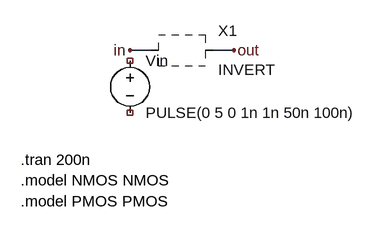
[diagram p0: schematic INVERT_test.asc]
INVERT_test.asc, the LTspice schematic file:
Version 4
.lib "C:\Users\ryano\OneDrive\Desktop\LogicLibraryAlt\simulation_build\ModelSp2025.txt"SHEET 1 880 680
WIRE 176 128 144 128
WIRE 304 128 272 128
FLAG 304 128 out
FLAG 144 128 in
SYMBOL INVERT 224 128 R0
SYMATTR InstName X1
SYMBOL voltage 144 128 R0
WINDOW 123 0 0 Left 0
WINDOW 39 0 0 Left 0
SYMATTR InstName Vin
SYMATTR Value PULSE(0 5 0 1n 1n 50n 100n)
TEXT -24 296 Left 2 !.tran 200n
TEXT -24 328 Left 2 !.model NMOS NMOS
TEXT -24 360 Left 2 !.model PMOS PMOS

The netlist it stands for:
* INVERT_test.asc
* X1: INVERT (symbol INVERT not available, pin order unknown); nets seen at it: in, out
Vin NC_01 NC_02 PULSE(0 5 0 1n 1n 50n 100n)
.tran 200n
.model NMOS NMOS
.model PMOS PMOS
.backanno
.end